# Altium schematic sheet X-23 IOMUX.SchDoc: FRDM-IMX93
size 513 x 436 mm; DrawnBy: FORLINX; Organization: ORGANIZATION; Address1: ADDRESS 1; Address2: ADDRESS 2; Address3: ADDRESS 3; Address4: ADDRESS 4; Revision: -; ENG_APP_DATE: --/--/--; DSN_APP_DATE: --/--/--; CHK_APP_DATE: --/--/--; Classification: Public, Company Internal/Proprietary, Company Confidential,  Company Secret; Page Create Date: March  8, 1995; OrgName: NXP Semiconductor; FIUO: A; OrgAddr1: NO. 192 Liangjing Rd. Pudong New Area, ShangHai; Page Number: 23; PageTitle: IOMUX; Page Size: Custom; Comment: TitleBlock_MCPG; Page Count: 23; Designer: FORLINX; RevCode: B1; Approver: NXP SE; Doc: SCH-94611 PDF: SPF-94611; DsnPath: T:\FILES\Designs\Single Board Computers\i.MX93-FRDM\Design Files\SCH-94611_B1.DSN; SchematicName: FRDM-i.MX 93 Development Board; PageName: X-23 IOMUX; PageSize: Custom; TopSchematic: True
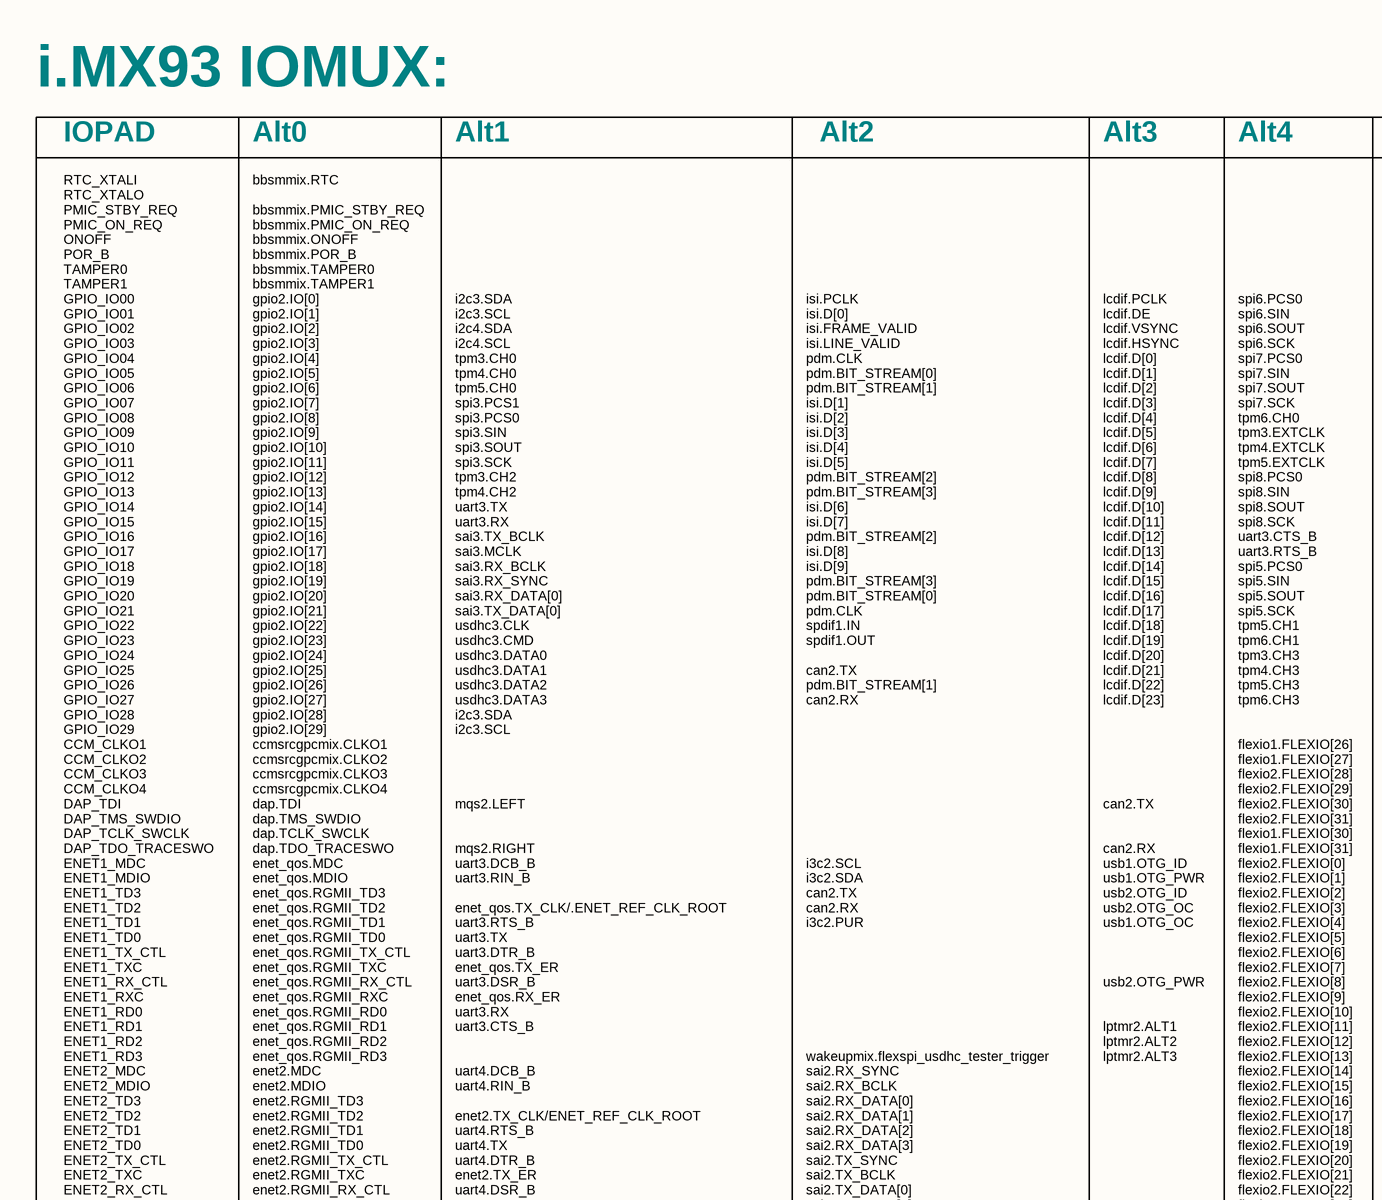
[diagram p0: X-23 IOMUX.SchDoc, top left]
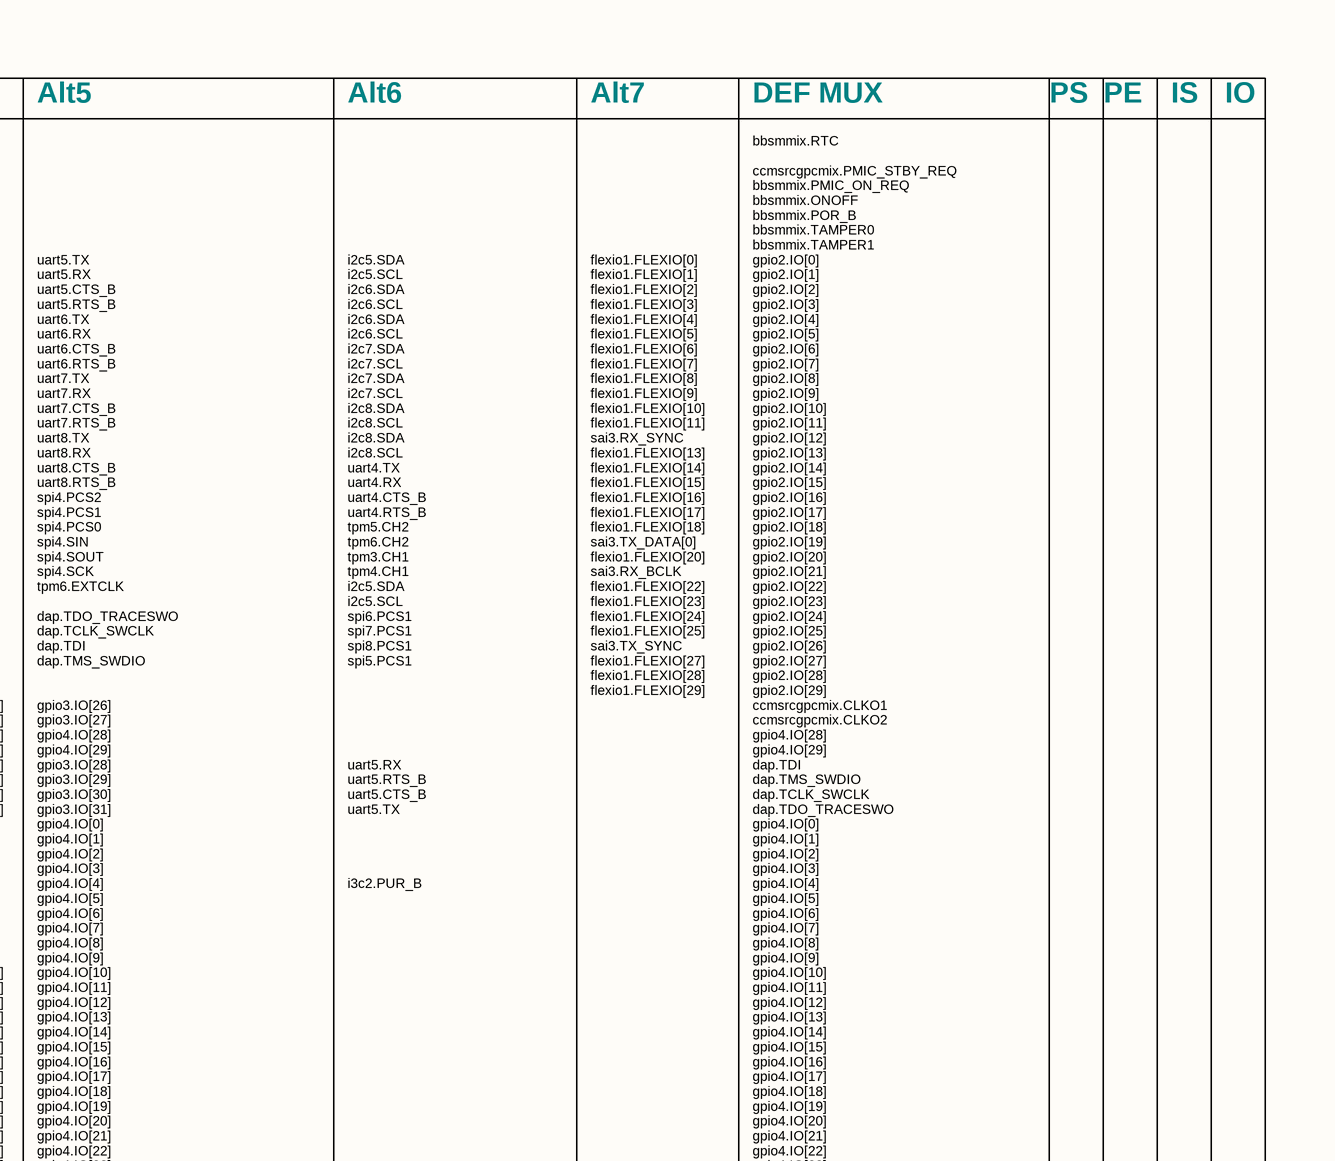
[diagram p1: X-23 IOMUX.SchDoc, top right]
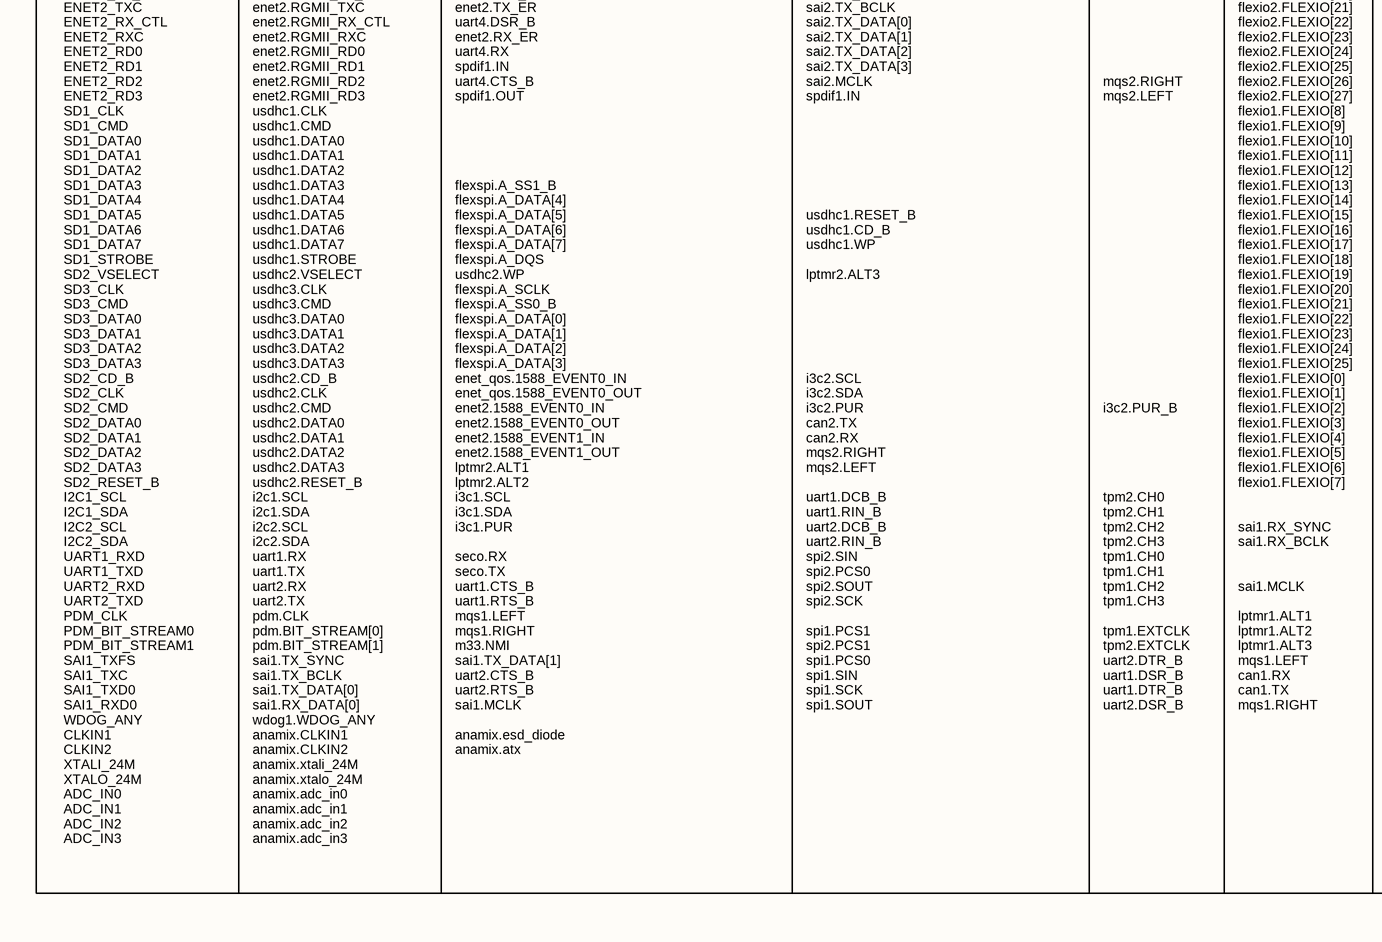
[diagram p2: X-23 IOMUX.SchDoc, bottom left]
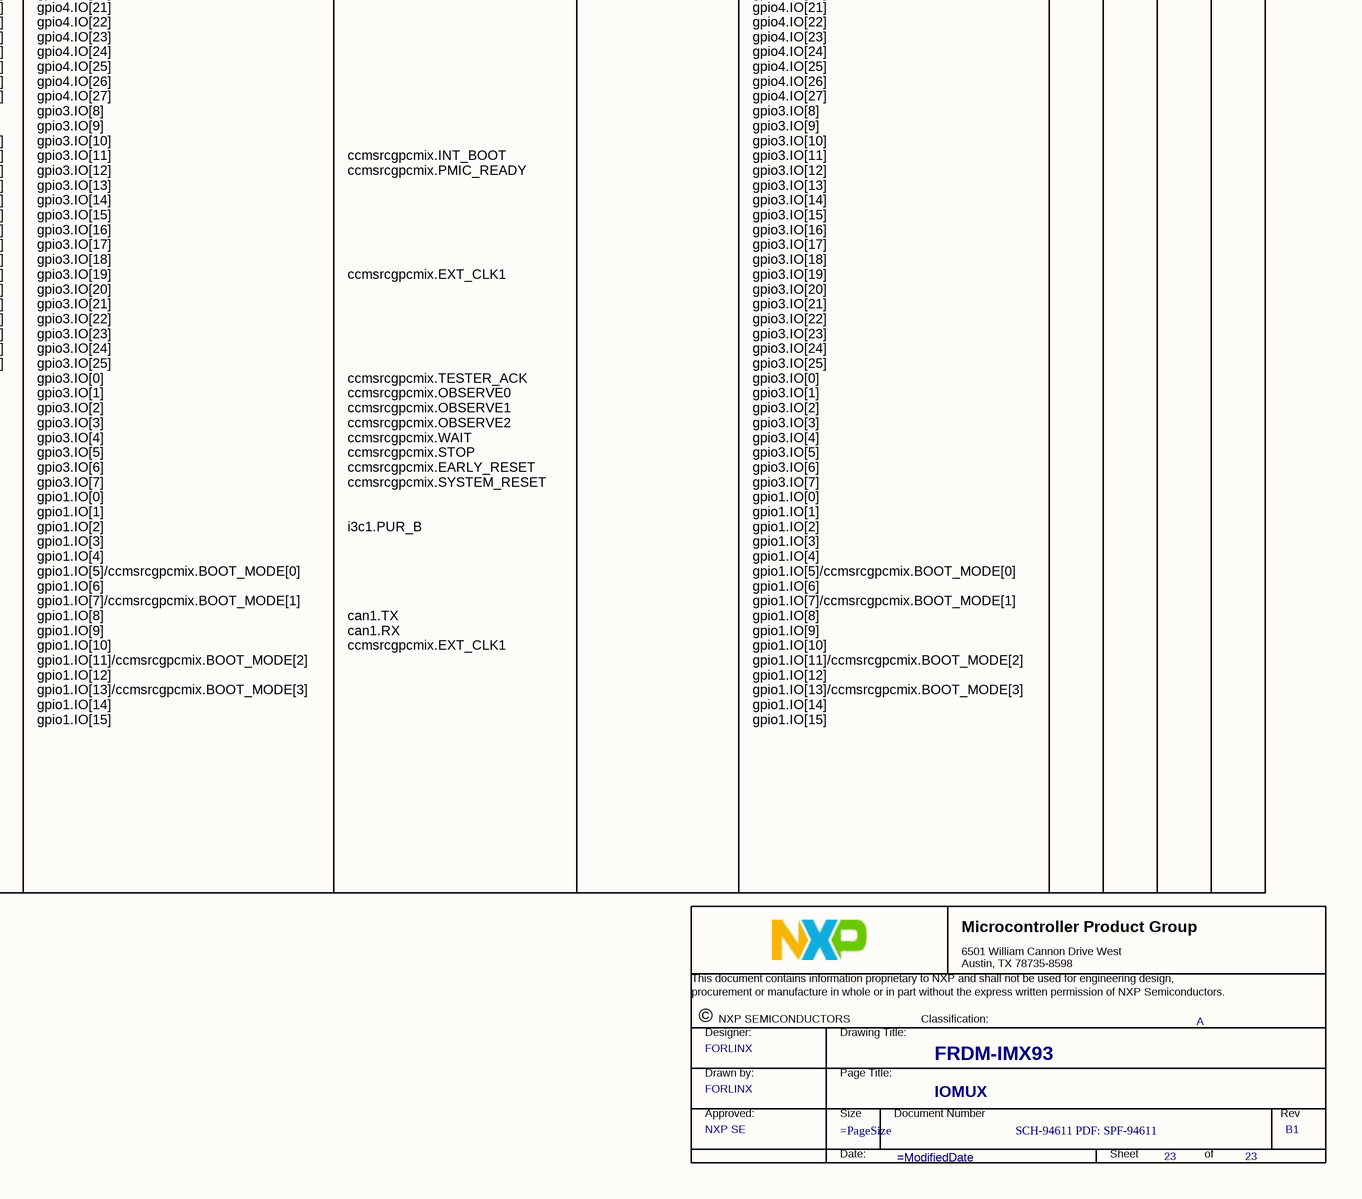
[diagram p3: X-23 IOMUX.SchDoc, bottom right]

## Parts
*  Title: FRDM-IMX93  RevCode: B1  PageTitle: IOMUX  Page Number: 23  DrawnBy: FORLINX  Doc: SCH-94611 PDF: SPF-94611  Approver: NXP SE  FIUO: A  (hidden comment: TitleBlock_MCPG)  (graphical)

## Notes on the sheet
- i.MX93 IOMUX:
- IOPAD
- Alt0
- Alt1
- Alt2
- Alt3
- Alt4
- Alt5
- Alt6
- Alt7
- DEF MUX
- PS
- PE
- IS
- IO
- bbsmmix.RTC
  ccmsrcgpcmix.PMIC_STBY_REQ
  bbsmmix.PMIC_ON_REQ
  bbsmmix.ONOFF
  bbsmmix.POR_B
  bbsmmix.TAMPER0
  bbsmmix.TAMPER1
  gpio2.IO[0]
  gpio2.IO[1]
  gpio2.IO[2]
  gpio2.IO[3]
  gpio2.IO[4]
  gpio2.IO[5]
  gpio2.IO[6]
  gpio2.IO[7]
  gpio2.IO[8]
  gpio2.IO[9]
  gpio2.IO[10]
  gpio2.IO[11]
  gpio2.IO[12]
  gpio2.IO[13]
  gpio2.IO[14]
  gpio2.IO[15]
  gpio2.IO[16]
  gpio2.IO[17]
  gpio2.IO[18]
  gpio2.IO[19]
  gpio2.IO[20]
  gpio2.IO[21]
  gpio2.IO[22]
  gpio2.IO[23]
  gpio2.IO[24]
  gpio2.IO[25]
  gpio2.IO[26]
  gpio2.IO[27]
  gpio2.IO[28]
  gpio2.IO[29]
  ccmsrcgpcmix.CLKO1
  ccmsrcgpcmix.CLKO2
  gpio4.IO[28]
  gpio4.IO[29]
  dap.TDI
  dap.TMS_SWDIO
  dap.TCLK_SWCLK
  dap.TDO_TRACESWO
  gpio4.IO[0]
  gpio4.IO[1]
  gpio4.IO[2]
  gpio4.IO[3]
  gpio4.IO[4]
  gpio4.IO[5]
  gpio4.IO[6]
  gpio4.IO[7]
  gpio4.IO[8]
  gpio4.IO[9]
  gpio4.IO[10]
  gpio4.IO[11]
  gpio4.IO[12]
  gpio4.IO[13]
  gpio4.IO[14]
  gpio4.IO[15]
  gpio4.IO[16]
  gpio4.IO[17]
  gpio4.IO[18]
  gpio4.IO[19]
  gpio4.IO[20]
  gpio4.IO[21]
  gpio4.IO[22]
  gpio4.IO[23]
  gpio4.IO[24]
  gpio4.IO[25]
  gpio4.IO[26]
  gpio4.IO[27]
  gpio3.IO[8]
  gpio3.IO[9]
  gpio3.IO[10]
  gpio3.IO[11]
  gpio3.IO[12]
  gpio3.IO[13]
  gpio3.IO[14]
  gpio3.IO[15]
  gpio3.IO[16]
  gpio3.IO[17]
  gpio3.IO[18]
  gpio3.IO[19]
  gpio3.IO[20]
  gpio3.IO[21]
  gpio3.IO[22]
  gpio3.IO[23]
  gpio3.IO[24]
  gpio3.IO[25]
  gpio3.IO[0]
  gpio3.IO[1]
  gpio3.IO[2]
  gpio3.IO[3]
  gpio3.IO[4]
  gpio3.IO[5]
  gpio3.IO[6]
  gpio3.IO[7]
  gpio1.IO[0]
  gpio1.IO[1]
  gpio1.IO[2]
  gpio1.IO[3]
  gpio1.IO[4]
  gpio1.IO[5]/ccmsrcgpcmix.BOOT_MODE[0]
  gpio1.IO[6]
  gpio1.IO[7]/ccmsrcgpcmix.BOOT_MODE[1]
  gpio1.IO[8]
  gpio1.IO[9]
  gpio1.IO[10]
  gpio1.IO[11]/ccmsrcgpcmix.BOOT_MODE[2]
  gpio1.IO[12]
  gpio1.IO[13]/ccmsrcgpcmix.BOOT_MODE[3]
  gpio1.IO[14]
  gpio1.IO[15]
- RTC_XTALI
  RTC_XTALO
  PMIC_STBY_REQ
  PMIC_ON_REQ
  ONOFF
  POR_B
  TAMPER0
  TAMPER1
  GPIO_IO00
  GPIO_IO01
  GPIO_IO02
  GPIO_IO03
  GPIO_IO04
  GPIO_IO05
  GPIO_IO06
  GPIO_IO07
  GPIO_IO08
  GPIO_IO09
  GPIO_IO10
  GPIO_IO11
  GPIO_IO12
  GPIO_IO13
  GPIO_IO14
  GPIO_IO15
  GPIO_IO16
  GPIO_IO17
  GPIO_IO18
  GPIO_IO19
  GPIO_IO20
  GPIO_IO21
  GPIO_IO22
  GPIO_IO23
  GPIO_IO24
  GPIO_IO25
  GPIO_IO26
  GPIO_IO27
  GPIO_IO28
  GPIO_IO29
  CCM_CLKO1
  CCM_CLKO2
  CCM_CLKO3
  CCM_CLKO4
  DAP_TDI
  DAP_TMS_SWDIO
  DAP_TCLK_SWCLK
  DAP_TDO_TRACESWO
  ENET1_MDC
  ENET1_MDIO
  ENET1_TD3
  ENET1_TD2
  ENET1_TD1
  ENET1_TD0
  ENET1_TX_CTL
  ENET1_TXC
  ENET1_RX_CTL
  ENET1_RXC
  ENET1_RD0
  ENET1_RD1
  ENET1_RD2
  ENET1_RD3
  ENET2_MDC
  ENET2_MDIO
  ENET2_TD3
  ENET2_TD2
  ENET2_TD1
  ENET2_TD0
  ENET2_TX_CTL
  ENET2_TXC
  ENET2_RX_CTL
  ENET2_RXC
  ENET2_RD0
  ENET2_RD1
  ENET2_RD2
  ENET2_RD3
  SD1_CLK
  SD1_CMD
  SD1_DATA0
  SD1_DATA1
  SD1_DATA2
  SD1_DATA3
  SD1_DATA4
  SD1_DATA5
  SD1_DATA6
  SD1_DATA7
  SD1_STROBE
  SD2_VSELECT
  SD3_CLK
  SD3_CMD
  SD3_DATA0
  SD3_DATA1
  SD3_DATA2
  SD3_DATA3
  SD2_CD_B
  SD2_CLK
  SD2_CMD
  SD2_DATA0
  SD2_DATA1
  SD2_DATA2
  SD2_DATA3
  SD2_RESET_B
  I2C1_SCL
  I2C1_SDA
  I2C2_SCL
  I2C2_SDA
  UART1_RXD
  UART1_TXD
  UART2_RXD
  UART2_TXD
  PDM_CLK
  PDM_BIT_STREAM0
  PDM_BIT_STREAM1
  SAI1_TXFS
  SAI1_TXC
  SAI1_TXD0
  SAI1_RXD0
  WDOG_ANY
  CLKIN1
  CLKIN2
  XTALI_24M
  XTALO_24M
  ADC_IN0
  ADC_IN1
  ADC_IN2
  ADC_IN3
- bbsmmix.RTC
  bbsmmix.PMIC_STBY_REQ
  bbsmmix.PMIC_ON_REQ
  bbsmmix.ONOFF
  bbsmmix.POR_B
  bbsmmix.TAMPER0
  bbsmmix.TAMPER1
  gpio2.IO[0]
  gpio2.IO[1]
  gpio2.IO[2]
  gpio2.IO[3]
  gpio2.IO[4]
  gpio2.IO[5]
  gpio2.IO[6]
  gpio2.IO[7]
  gpio2.IO[8]
  gpio2.IO[9]
  gpio2.IO[10]
  gpio2.IO[11]
  gpio2.IO[12]
  gpio2.IO[13]
  gpio2.IO[14]
  gpio2.IO[15]
  gpio2.IO[16]
  gpio2.IO[17]
  gpio2.IO[18]
  gpio2.IO[19]
  gpio2.IO[20]
  gpio2.IO[21]
  gpio2.IO[22]
  gpio2.IO[23]
  gpio2.IO[24]
  gpio2.IO[25]
  gpio2.IO[26]
  gpio2.IO[27]
  gpio2.IO[28]
  gpio2.IO[29]
  ccmsrcgpcmix.CLKO1
  ccmsrcgpcmix.CLKO2
  ccmsrcgpcmix.CLKO3
  ccmsrcgpcmix.CLKO4
  dap.TDI
  dap.TMS_SWDIO
  dap.TCLK_SWCLK
  dap.TDO_TRACESWO
  enet_qos.MDC
  enet_qos.MDIO
  enet_qos.RGMII_TD3
  enet_qos.RGMII_TD2
  enet_qos.RGMII_TD1
  enet_qos.RGMII_TD0
  enet_qos.RGMII_TX_CTL
  enet_qos.RGMII_TXC
  enet_qos.RGMII_RX_CTL
  enet_qos.RGMII_RXC
  enet_qos.RGMII_RD0
  enet_qos.RGMII_RD1
  enet_qos.RGMII_RD2
  enet_qos.RGMII_RD3
  enet2.MDC
  enet2.MDIO
  enet2.RGMII_TD3
  enet2.RGMII_TD2
  enet2.RGMII_TD1
  enet2.RGMII_TD0
  enet2.RGMII_TX_CTL
  enet2.RGMII_TXC
  enet2.RGMII_RX_CTL
  enet2.RGMII_RXC
  enet2.RGMII_RD0
  enet2.RGMII_RD1
  enet2.RGMII_RD2
  enet2.RGMII_RD3
  usdhc1.CLK
  usdhc1.CMD
  usdhc1.DATA0
  usdhc1.DATA1
  usdhc1.DATA2
  usdhc1.DATA3
  usdhc1.DATA4
  usdhc1.DATA5
  usdhc1.DATA6
  usdhc1.DATA7
  usdhc1.STROBE
  usdhc2.VSELECT
  usdhc3.CLK
  usdhc3.CMD
  usdhc3.DATA0
  usdhc3.DATA1
  usdhc3.DATA2
  usdhc3.DATA3
  usdhc2.CD_B
  usdhc2.CLK
  usdhc2.CMD
  usdhc2.DATA0
  usdhc2.DATA1
  usdhc2.DATA2
  usdhc2.DATA3
  usdhc2.RESET_B
  i2c1.SCL
  i2c1.SDA
  i2c2.SCL
  i2c2.SDA
  uart1.RX
  uart1.TX
  uart2.RX
  uart2.TX
  pdm.CLK
  pdm.BIT_STREAM[0]
  pdm.BIT_STREAM[1]
  sai1.TX_SYNC
  sai1.TX_BCLK
  sai1.TX_DATA[0]
  sai1.RX_DATA[0]
  wdog1.WDOG_ANY
  anamix.CLKIN1
  anamix.CLKIN2
  anamix.xtali_24M
  anamix.xtalo_24M
  anamix.adc_in0
  anamix.adc_in1
  anamix.adc_in2
  anamix.adc_in3
- i2c3.SDA
  i2c3.SCL
  i2c4.SDA
  i2c4.SCL
  tpm3.CH0
  tpm4.CH0
  tpm5.CH0
  spi3.PCS1
  spi3.PCS0
  spi3.SIN
  spi3.SOUT
  spi3.SCK
  tpm3.CH2
  tpm4.CH2
  uart3.TX
  uart3.RX
  sai3.TX_BCLK
  sai3.MCLK
  sai3.RX_BCLK
  sai3.RX_SYNC
  sai3.RX_DATA[0]
  sai3.TX_DATA[0]
  usdhc3.CLK
  usdhc3.CMD
  usdhc3.DATA0
  usdhc3.DATA1
  usdhc3.DATA2
  usdhc3.DATA3
  i2c3.SDA
  i2c3.SCL
  mqs2.LEFT
  mqs2.RIGHT
  uart3.DCB_B
  uart3.RIN_B
  enet_qos.TX_CLK/.ENET_REF_CLK_ROOT
  uart3.RTS_B
  uart3.TX
  uart3.DTR_B
  enet_qos.TX_ER
  uart3.DSR_B
  enet_qos.RX_ER
  uart3.RX
  uart3.CTS_B
  uart4.DCB_B
  uart4.RIN_B
  enet2.TX_CLK/ENET_REF_CLK_ROOT
  uart4.RTS_B
  uart4.TX
  uart4.DTR_B
  enet2.TX_ER
  uart4.DSR_B
  enet2.RX_ER
  uart4.RX
  spdif1.IN
  uart4.CTS_B
  spdif1.OUT
  flexspi.A_SS1_B
  flexspi.A_DATA[4]
  flexspi.A_DATA[5]
  flexspi.A_DATA[6]
  flexspi.A_DATA[7]
  flexspi.A_DQS
  usdhc2.WP
  flexspi.A_SCLK
  flexspi.A_SS0_B
  flexspi.A_DATA[0]
  flexspi.A_DATA[1]
  flexspi.A_DATA[2]
  flexspi.A_DATA[3]
  enet_qos.1588_EVENT0_IN
  enet_qos.1588_EVENT0_OUT
  enet2.1588_EVENT0_IN
  enet2.1588_EVENT0_OUT
  enet2.1588_EVENT1_IN
  enet2.1588_EVENT1_OUT
  lptmr2.ALT1
  lptmr2.ALT2
  i3c1.SCL
  i3c1.SDA
  i3c1.PUR
  seco.RX
  seco.TX
  uart1.CTS_B
  uart1.RTS_B
  mqs1.LEFT
  mqs1.RIGHT
  m33.NMI
  sai1.TX_DATA[1]
  uart2.CTS_B
  uart2.RTS_B
  sai1.MCLK
  anamix.esd_diode
  anamix.atx
- isi.PCLK
  isi.D[0]
  isi.FRAME_VALID
  isi.LINE_VALID
  pdm.CLK
  pdm.BIT_STREAM[0]
  pdm.BIT_STREAM[1]
  isi.D[1]
  isi.D[2]
  isi.D[3]
  isi.D[4]
  isi.D[5]
  pdm.BIT_STREAM[2]
  pdm.BIT_STREAM[3]
  isi.D[6]
  isi.D[7]
  pdm.BIT_STREAM[2]
  isi.D[8]
  isi.D[9]
  pdm.BIT_STREAM[3]
  pdm.BIT_STREAM[0]
  pdm.CLK
  spdif1.IN
  spdif1.OUT
  can2.TX
  pdm.BIT_STREAM[1]
  can2.RX
  i3c2.SCL
  i3c2.SDA
  can2.TX
  can2.RX
  i3c2.PUR
  wakeupmix.flexspi_usdhc_tester_trigger
  sai2.RX_SYNC
  sai2.RX_BCLK
  sai2.RX_DATA[0]
  sai2.RX_DATA[1]
  sai2.RX_DATA[2]
  sai2.RX_DATA[3]
  sai2.TX_SYNC
  sai2.TX_BCLK
  sai2.TX_DATA[0]
  sai2.TX_DATA[1]
  sai2.TX_DATA[2]
  sai2.TX_DATA[3]
  sai2.MCLK
  spdif1.IN
  usdhc1.RESET_B
  usdhc1.CD_B
  usdhc1.WP
  lptmr2.ALT3
  i3c2.SCL
  i3c2.SDA
  i3c2.PUR
  can2.TX
  can2.RX
  mqs2.RIGHT
  mqs2.LEFT
  uart1.DCB_B
  uart1.RIN_B
  uart2.DCB_B
  uart2.RIN_B
  spi2.SIN
  spi2.PCS0
  spi2.SOUT
  spi2.SCK
  spi1.PCS1
  spi2.PCS1
  spi1.PCS0
  spi1.SIN
  spi1.SCK
  spi1.SOUT
- lcdif.PCLK
  lcdif.DE
  lcdif.VSYNC
  lcdif.HSYNC
  lcdif.D[0]
  lcdif.D[1]
  lcdif.D[2]
  lcdif.D[3]
  lcdif.D[4]
  lcdif.D[5]
  lcdif.D[6]
  lcdif.D[7]
  lcdif.D[8]
  lcdif.D[9]
  lcdif.D[10]
  lcdif.D[11]
  lcdif.D[12]
  lcdif.D[13]
  lcdif.D[14]
  lcdif.D[15]
  lcdif.D[16]
  lcdif.D[17]
  lcdif.D[18]
  lcdif.D[19]
  lcdif.D[20]
  lcdif.D[21]
  lcdif.D[22]
  lcdif.D[23]
  can2.TX
  can2.RX
  usb1.OTG_ID
  usb1.OTG_PWR
  usb2.OTG_ID
  usb2.OTG_OC
  usb1.OTG_OC
  usb2.OTG_PWR
  lptmr2.ALT1
  lptmr2.ALT2
  lptmr2.ALT3
  mqs2.RIGHT
  mqs2.LEFT
  i3c2.PUR_B
  tpm2.CH0
  tpm2.CH1
  tpm2.CH2
  tpm2.CH3
  tpm1.CH0
  tpm1.CH1
  tpm1.CH2
  tpm1.CH3
  tpm1.EXTCLK
  tpm2.EXTCLK
  uart2.DTR_B
  uart1.DSR_B
  uart1.DTR_B
  uart2.DSR_B
- spi6.PCS0
  spi6.SIN
  spi6.SOUT
  spi6.SCK
  spi7.PCS0
  spi7.SIN
  spi7.SOUT
  spi7.SCK
  tpm6.CH0
  tpm3.EXTCLK
  tpm4.EXTCLK
  tpm5.EXTCLK
  spi8.PCS0
  spi8.SIN
  spi8.SOUT
  spi8.SCK
  uart3.CTS_B
  uart3.RTS_B
  spi5.PCS0
  spi5.SIN
  spi5.SOUT
  spi5.SCK
  tpm5.CH1
  tpm6.CH1
  tpm3.CH3
  tpm4.CH3
  tpm5.CH3
  tpm6.CH3
  flexio1.FLEXIO[26]
  flexio1.FLEXIO[27]
  flexio2.FLEXIO[28]
  flexio2.FLEXIO[29]
  flexio2.FLEXIO[30]
  flexio2.FLEXIO[31]
  flexio1.FLEXIO[30]
  flexio1.FLEXIO[31]
  flexio2.FLEXIO[0]
  flexio2.FLEXIO[1]
  flexio2.FLEXIO[2]
  flexio2.FLEXIO[3]
  flexio2.FLEXIO[4]
  flexio2.FLEXIO[5]
  flexio2.FLEXIO[6]
  flexio2.FLEXIO[7]
  flexio2.FLEXIO[8]
  flexio2.FLEXIO[9]
  flexio2.FLEXIO[10]
  flexio2.FLEXIO[11]
  flexio2.FLEXIO[12]
  flexio2.FLEXIO[13]
  flexio2.FLEXIO[14]
  flexio2.FLEXIO[15]
  flexio2.FLEXIO[16]
  flexio2.FLEXIO[17]
  flexio2.FLEXIO[18]
  flexio2.FLEXIO[19]
  flexio2.FLEXIO[20]
  flexio2.FLEXIO[21]
  flexio2.FLEXIO[22]
  flexio2.FLEXIO[23]
  flexio2.FLEXIO[24]
  flexio2.FLEXIO[25]
  flexio2.FLEXIO[26]
  flexio2.FLEXIO[27]
  flexio1.FLEXIO[8]
  flexio1.FLEXIO[9]
  flexio1.FLEXIO[10]
  flexio1.FLEXIO[11]
  flexio1.FLEXIO[12]
  flexio1.FLEXIO[13]
  flexio1.FLEXIO[14]
  flexio1.FLEXIO[15]
  flexio1.FLEXIO[16]
  flexio1.FLEXIO[17]
  flexio1.FLEXIO[18]
  flexio1.FLEXIO[19]
  flexio1.FLEXIO[20]
  flexio1.FLEXIO[21]
  flexio1.FLEXIO[22]
  flexio1.FLEXIO[23]
  flexio1.FLEXIO[24]
  flexio1.FLEXIO[25]
  flexio1.FLEXIO[0]
  flexio1.FLEXIO[1]
  flexio1.FLEXIO[2]
  flexio1.FLEXIO[3]
  flexio1.FLEXIO[4]
  flexio1.FLEXIO[5]
  flexio1.FLEXIO[6]
  flexio1.FLEXIO[7]
  sai1.RX_SYNC
  sai1.RX_BCLK
  sai1.MCLK
  lptmr1.ALT1
  lptmr1.ALT2
  lptmr1.ALT3
  mqs1.LEFT
  can1.RX
  can1.TX
  mqs1.RIGHT
- uart5.TX
  uart5.RX
  uart5.CTS_B
  uart5.RTS_B
  uart6.TX
  uart6.RX
  uart6.CTS_B
  uart6.RTS_B
  uart7.TX
  uart7.RX
  uart7.CTS_B
  uart7.RTS_B
  uart8.TX
  uart8.RX
  uart8.CTS_B
  uart8.RTS_B
  spi4.PCS2
  spi4.PCS1
  spi4.PCS0
  spi4.SIN
  spi4.SOUT
  spi4.SCK
  tpm6.EXTCLK
  dap.TDO_TRACESWO
  dap.TCLK_SWCLK
  dap.TDI
  dap.TMS_SWDIO
  gpio3.IO[26]
  gpio3.IO[27]
  gpio4.IO[28]
  gpio4.IO[29]
  gpio3.IO[28]
  gpio3.IO[29]
  gpio3.IO[30]
  gpio3.IO[31]
  gpio4.IO[0]
  gpio4.IO[1]
  gpio4.IO[2]
  gpio4.IO[3]
  gpio4.IO[4]
  gpio4.IO[5]
  gpio4.IO[6]
  gpio4.IO[7]
  gpio4.IO[8]
  gpio4.IO[9]
  gpio4.IO[10]
  gpio4.IO[11]
  gpio4.IO[12]
  gpio4.IO[13]
  gpio4.IO[14]
  gpio4.IO[15]
  gpio4.IO[16]
  gpio4.IO[17]
  gpio4.IO[18]
  gpio4.IO[19]
  gpio4.IO[20]
  gpio4.IO[21]
  gpio4.IO[22]
  gpio4.IO[23]
  gpio4.IO[24]
  gpio4.IO[25]
  gpio4.IO[26]
  gpio4.IO[27]
  gpio3.IO[8]
  gpio3.IO[9]
  gpio3.IO[10]
  gpio3.IO[11]
  gpio3.IO[12]
  gpio3.IO[13]
  gpio3.IO[14]
  gpio3.IO[15]
  gpio3.IO[16]
  gpio3.IO[17]
  gpio3.IO[18]
  gpio3.IO[19]
  gpio3.IO[20]
  gpio3.IO[21]
  gpio3.IO[22]
  gpio3.IO[23]
  gpio3.IO[24]
  gpio3.IO[25]
  gpio3.IO[0]
  gpio3.IO[1]
  gpio3.IO[2]
  gpio3.IO[3]
  gpio3.IO[4]
  gpio3.IO[5]
  gpio3.IO[6]
  gpio3.IO[7]
  gpio1.IO[0]
  gpio1.IO[1]
  gpio1.IO[2]
  gpio1.IO[3]
  gpio1.IO[4]
  gpio1.IO[5]/ccmsrcgpcmix.BOOT_MODE[0]
  gpio1.IO[6]
  gpio1.IO[7]/ccmsrcgpcmix.BOOT_MODE[1]
  gpio1.IO[8]
  gpio1.IO[9]
  gpio1.IO[10]
  gpio1.IO[11]/ccmsrcgpcmix.BOOT_MODE[2]
  gpio1.IO[12]
  gpio1.IO[13]/ccmsrcgpcmix.BOOT_MODE[3]
  gpio1.IO[14]
  gpio1.IO[15]
- i2c5.SDA
  i2c5.SCL
  i2c6.SDA
  i2c6.SCL
  i2c6.SDA
  i2c6.SCL
  i2c7.SDA
  i2c7.SCL
  i2c7.SDA
  i2c7.SCL
  i2c8.SDA
  i2c8.SCL
  i2c8.SDA
  i2c8.SCL
  uart4.TX
  uart4.RX
  uart4.CTS_B
  uart4.RTS_B
  tpm5.CH2
  tpm6.CH2
  tpm3.CH1
  tpm4.CH1
  i2c5.SDA
  i2c5.SCL
  spi6.PCS1
  spi7.PCS1
  spi8.PCS1
  spi5.PCS1
  uart5.RX
  uart5.RTS_B
  uart5.CTS_B
  uart5.TX
  i3c2.PUR_B
  ccmsrcgpcmix.INT_BOOT
  ccmsrcgpcmix.PMIC_READY
  ccmsrcgpcmix.EXT_CLK1
  ccmsrcgpcmix.TESTER_ACK
  ccmsrcgpcmix.OBSERVE0
  ccmsrcgpcmix.OBSERVE1
  ccmsrcgpcmix.OBSERVE2
  ccmsrcgpcmix.WAIT
  ccmsrcgpcmix.STOP
  ccmsrcgpcmix.EARLY_RESET
  ccmsrcgpcmix.SYSTEM_RESET
  i3c1.PUR_B
  can1.TX
  can1.RX
  ccmsrcgpcmix.EXT_CLK1
- flexio1.FLEXIO[0]
  flexio1.FLEXIO[1]
  flexio1.FLEXIO[2]
  flexio1.FLEXIO[3]
  flexio1.FLEXIO[4]
  flexio1.FLEXIO[5]
  flexio1.FLEXIO[6]
  flexio1.FLEXIO[7]
  flexio1.FLEXIO[8]
  flexio1.FLEXIO[9]
  flexio1.FLEXIO[10]
  flexio1.FLEXIO[11]
  sai3.RX_SYNC
  flexio1.FLEXIO[13]
  flexio1.FLEXIO[14]
  flexio1.FLEXIO[15]
  flexio1.FLEXIO[16]
  flexio1.FLEXIO[17]
  flexio1.FLEXIO[18]
  sai3.TX_DATA[0]
  flexio1.FLEXIO[20]
  sai3.RX_BCLK
  flexio1.FLEXIO[22]
  flexio1.FLEXIO[23]
  flexio1.FLEXIO[24]
  flexio1.FLEXIO[25]
  sai3.TX_SYNC
  flexio1.FLEXIO[27]
  flexio1.FLEXIO[28]
  flexio1.FLEXIO[29]
- DWG. NO.
- REV.
- SHT.
- REVISION
- DESCRIPTION
- DATE
- APPROVED
- ENG:
- APPROVALS
- quilter.ai <http://quilter.ai>
- DSN:
- CHK:
- REFERENCE DOCUMENTS
- TITLE
- PROJECT
- BOM:
- FAB DWG:
- PCB DWG:
- ASSY DWG:
- SIZE
- FILE NAME
- C
- DWG NO.
- SHEET
- OF
- REV
- (in symbol TitleBlock_MCPG) Microcontroller Product Group; 6501 William Cannon Drive West / Austin, TX 78735-8598; This document contains information proprietary to NXP and shall not be used for engineering design,; procurement or manufacture in whole or in part without the express written permission of NXP Semiconductors.; ©; NXP SEMICONDUCTORS; Classification:; Designer:; Drawing Title:; Drawn by:; Page Title:; Approved:; Size; Document Number; Rev; Date:; Sheet; of

## Library data of the parts
* = TitleBlock_MCPG: Classification: Public, Company Internal/Proprietary, Company Confidential,  Company Secret; OrgName: NXP Semiconductor; OrgAddr1: NO. 192 Liangjing Rd. Pudong New Area, ShangHai; Page Size: =PageSize; Page Create Date: March  8, 1995; Page Count: 23; Designer: FORLINX; Page Modify Date: =ModifiedDate